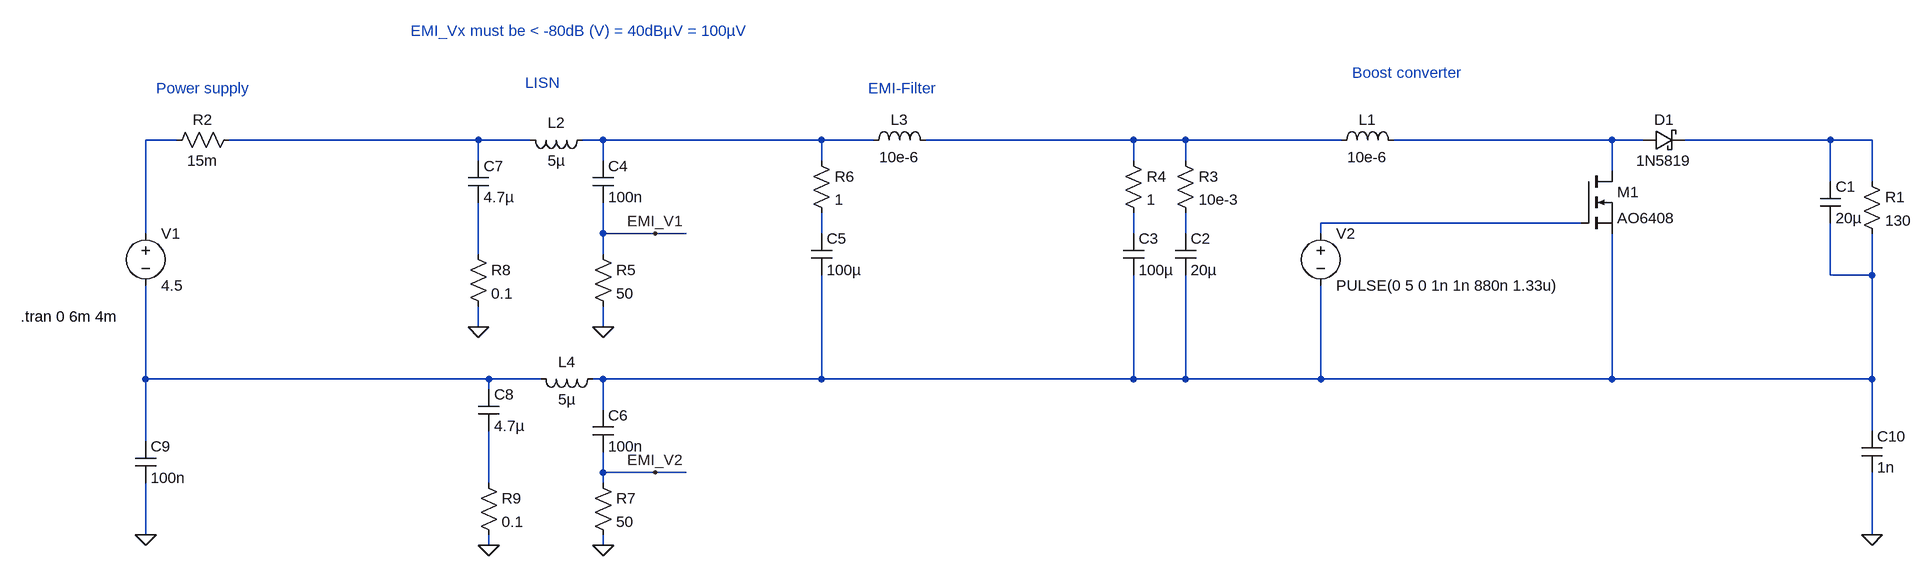
[diagram p0: schematic boost.asc]
boost.asc, the LTspice schematic file:
Version 4
SHEET 1 1028 708
WIRE -1648 64 -1696 64
WIRE -1184 64 -1568 64
WIRE -1104 64 -1184 64
WIRE -992 64 -1024 64
WIRE -656 64 -992 64
WIRE -576 64 -656 64
WIRE -176 64 -496 64
WIRE -96 64 -176 64
WIRE 144 64 -96 64
WIRE 560 64 224 64
WIRE 608 64 560 64
WIRE 896 64 672 64
WIRE 960 64 896 64
WIRE -1184 96 -1184 64
WIRE -992 96 -992 64
WIRE -656 96 -656 64
WIRE -176 96 -176 64
WIRE -96 96 -96 64
WIRE 560 112 560 64
WIRE 896 128 896 64
WIRE 960 128 960 64
WIRE 512 192 112 192
WIRE -1696 208 -1696 64
WIRE -992 208 -992 160
WIRE -912 208 -992 208
WIRE -864 208 -912 208
WIRE -656 208 -656 176
WIRE -176 208 -176 176
WIRE -96 208 -96 176
WIRE 112 208 112 192
WIRE -1184 240 -1184 160
WIRE -992 240 -992 208
WIRE 896 272 896 192
WIRE 960 272 960 208
WIRE 960 272 896 272
WIRE -1184 352 -1184 320
WIRE -992 352 -992 320
WIRE -1696 432 -1696 288
WIRE -1168 432 -1696 432
WIRE -1088 432 -1168 432
WIRE -992 432 -1008 432
WIRE -656 432 -656 272
WIRE -656 432 -992 432
WIRE -176 432 -176 272
WIRE -176 432 -656 432
WIRE -96 432 -96 272
WIRE -96 432 -176 432
WIRE 112 432 112 288
WIRE 112 432 -96 432
WIRE 560 432 560 208
WIRE 560 432 112 432
WIRE 960 432 960 272
WIRE 960 432 560 432
WIRE -1168 448 -1168 432
WIRE -992 480 -992 432
WIRE 960 512 960 432
WIRE -1696 528 -1696 432
WIRE -992 576 -992 544
WIRE -912 576 -992 576
WIRE -864 576 -912 576
WIRE -1168 592 -1168 512
WIRE -992 592 -992 576
WIRE -1696 672 -1696 592
WIRE 960 672 960 576
WIRE -1168 688 -1168 672
WIRE -992 688 -992 672
FLAG -992 352 0
FLAG -912 208 EMI_V1
FLAG -992 688 0
FLAG -1184 352 0
FLAG -1168 688 0
FLAG -912 576 EMI_V2
FLAG 960 672 0
FLAG -1696 672 0
SYMBOL voltage -1696 192 R0
SYMATTR InstName V1
SYMATTR Value 4.5
SYMBOL ind 128 80 R270
WINDOW 0 32 56 VTop 2
WINDOW 3 5 56 VBottom 2
SYMATTR InstName L1
SYMATTR Value 10e-6
SYMBOL schottky 608 80 R270
WINDOW 0 32 32 VTop 2
WINDOW 3 0 32 VBottom 2
SYMATTR InstName D1
SYMATTR Value 1N5819
SYMATTR Description Diode
SYMATTR Type diode
SYMBOL res 944 112 R0
SYMATTR InstName R1
SYMATTR Value 130
SYMBOL voltage 112 192 R0
WINDOW 123 0 0 Left 0
WINDOW 39 0 0 Left 0
SYMATTR InstName V2
SYMATTR Value PULSE(0 5 0 1n 1n 880n 1.33u)
SYMBOL nmos 512 112 R0
SYMATTR InstName M1
SYMATTR Value AO6408
SYMBOL cap 880 128 R0
SYMATTR InstName C1
SYMATTR Value 20µ
SYMBOL res -1552 48 R90
WINDOW 0 0 56 VBottom 2
WINDOW 3 32 56 VTop 2
SYMATTR InstName R2
SYMATTR Value 15m
SYMBOL ind -1008 48 R90
WINDOW 0 5 56 VBottom 2
WINDOW 3 32 56 VTop 2
SYMATTR InstName L2
SYMATTR Value 5µ
SYMBOL res -112 80 R0
SYMATTR InstName R3
SYMATTR Value 10e-3
SYMBOL cap -112 208 R0
SYMATTR InstName C2
SYMATTR Value 20µ
SYMBOL cap -192 208 R0
SYMATTR InstName C3
SYMATTR Value 100µ
SYMBOL res -192 80 R0
SYMATTR InstName R4
SYMATTR Value 1
SYMBOL cap -1008 96 R0
SYMATTR InstName C4
SYMATTR Value 100n
SYMBOL res -1008 224 R0
SYMATTR InstName R5
SYMATTR Value 50
SYMBOL ind -592 80 R270
WINDOW 0 32 56 VTop 2
WINDOW 3 5 56 VBottom 2
SYMATTR InstName L3
SYMATTR Value 10e-6
SYMBOL res -672 80 R0
SYMATTR InstName R6
SYMATTR Value 1
SYMBOL cap -672 208 R0
SYMATTR InstName C5
SYMATTR Value 100µ
SYMBOL cap -1008 480 R0
SYMATTR InstName C6
SYMATTR Value 100n
SYMBOL res -1008 576 R0
SYMATTR InstName R7
SYMATTR Value 50
SYMBOL ind -992 416 R90
WINDOW 0 5 56 VBottom 2
WINDOW 3 32 56 VTop 2
SYMATTR InstName L4
SYMATTR Value 5µ
SYMBOL cap -1200 96 R0
SYMATTR InstName C7
SYMATTR Value 4.7µ
SYMBOL res -1200 224 R0
SYMATTR InstName R8
SYMATTR Value 0.1
SYMBOL res -1184 576 R0
SYMATTR InstName R9
SYMATTR Value 0.1
SYMBOL cap -1184 448 R0
SYMATTR InstName C8
SYMATTR Value 4.7µ
SYMBOL cap 944 512 R0
SYMATTR InstName C10
SYMATTR Value 1n
SYMBOL cap -1712 528 R0
SYMATTR InstName C9
SYMATTR Value 100n
TEXT -1888 336 Left 2 !.tran 0 6m 4m
TEXT -1680 -16 Left 2 ;Power supply
TEXT -1112 -24 Left 2 ;LISN
TEXT 160 -40 Left 2 ;Boost converter
TEXT -584 -16 Left 2 ;EMI-Filter
TEXT -1288 -104 Left 2 ;EMI_Vx must be < -80dB (V) = 40dBµV = 100µV

The netlist it stands for:
* boost.asc
V1 N001 N013 4.5
L1 N004 N005 10e-6
D1 N005 N006 1N5819
R1 N006 N012 130
V2 N007 N012 PULSE(0 5 0 1n 1n 880n 1.33u)
M1 N005 N007 N012 N012 AO6408
C1 N006 N012 20µ
R2 N002 N001 15m
L2 N003 N002 5µ
R3 N004 N010 10e-3
C2 N010 N012 20µ
C3 N009 N012 100µ
R4 N004 N009 1
C4 N003 EMI_V1 100n
R5 EMI_V1 0 50
L3 N003 N004 10e-6
R6 N003 N008 1
C5 N008 N012 100µ
C6 N012 EMI_V2 100n
R7 EMI_V2 0 50
L4 N012 N013 5µ
C7 N002 N011 4.7µ
R8 N011 0 0.1
R9 N014 0 0.1
C8 N013 N014 4.7µ
C10 N012 0 1n
C9 N013 0 100n
.model D D
.lib standard.dio
.model NMOS NMOS
.model PMOS PMOS
.lib standard.mos
.tran 0 6m 4m
* Power supply
* LISN
* Boost converter
* EMI-Filter
* EMI_Vx must be < -80dB (V) = 40dBµV = 100µV
.backanno
.end